# EAGLE design fpc_cable_all (EAGLE 9.6.2)
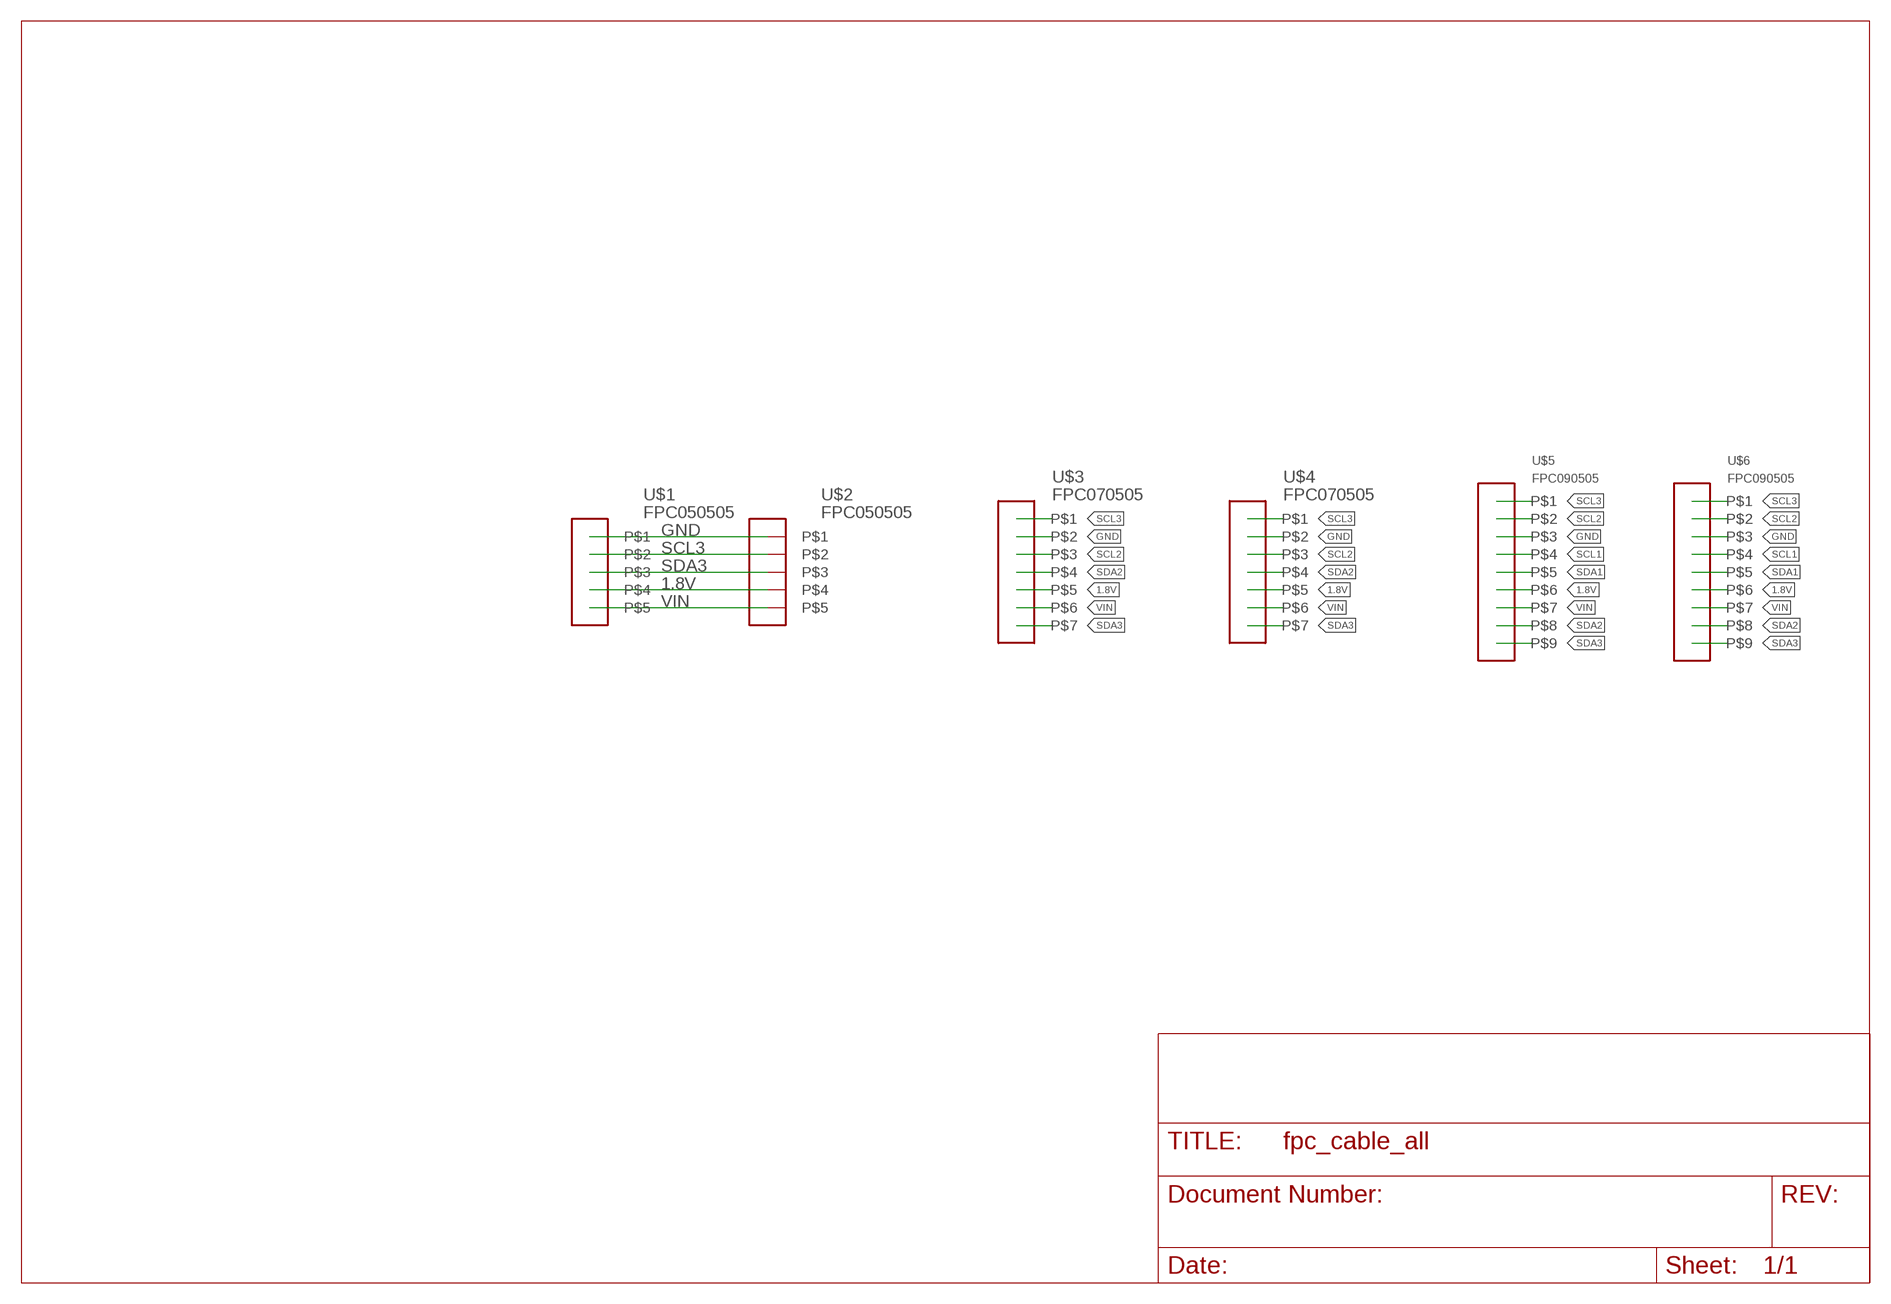
[diagram p0: schematic, sheet 1]

## Parts
U$1  FPC050505  [FPC0505]
U$2  FPC050505  [FPC0505]
U$3  FPC070505  [FPC0705]
U$4  FPC070505  [FPC0705]
U$5  FPC090505  [FPC0905]
U$6  FPC090505  [FPC0905]

## Nets
1.8V: U$1.P$4 U$2.P$4 U$3.P$5 U$4.P$5 U$5.P$6 U$6.P$6
GND: U$1.P$1 U$2.P$1 U$3.P$2 U$4.P$2 U$5.P$3 U$6.P$3
SCL1: U$5.P$4 U$6.P$4
SCL2: U$3.P$3 U$4.P$3 U$5.P$2 U$6.P$2
SCL3: U$1.P$2 U$2.P$2 U$3.P$1 U$4.P$1 U$5.P$1 U$6.P$1
SDA1: U$5.P$5 U$6.P$5
SDA2: U$3.P$4 U$4.P$4 U$5.P$8 U$6.P$8
SDA3: U$1.P$3 U$2.P$3 U$3.P$7 U$4.P$7 U$5.P$9 U$6.P$9
VIN: U$1.P$5 U$2.P$5 U$3.P$6 U$4.P$6 U$5.P$7 U$6.P$7

## Library data of the parts
U$1 U$2 = my_library:FPC0505
U$3 U$4 = my_library:FPC0705
U$5 U$6 = my_library:FPC0905

## Board
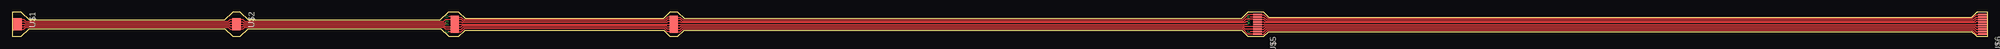
[diagram p1: board, top side]
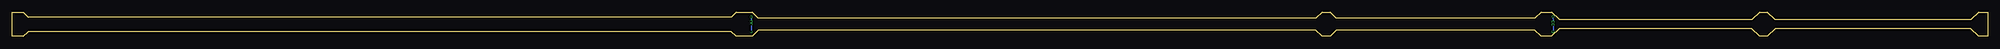
[diagram p2: board, bottom side, seen from below]

Size 406.1 x 5 mm. Coordinates in mm from the lower left corner, seen from the top.
Outline: 0,0 1.9,0 3.5,1.6 43.7,1.6 45.3,0 46.9,0 48.5,1.6 88.1,1.6 89.7,0 91.8,0 93.1,1.3 133.9,1.3 135.2,0 136.8,0 138.1,1.3 252.7,1.3 254,0 257.3,0 258.3,1 402.8,1 403.8,0 406.1,0 406.1,5 403.8,5 402.8,4 258.3,4 257.3,5 254,5 252.7,3.7 138.1,3.7 136.8,5 135.2,5 133.9,3.7 93.1,3.7 91.8,5 89.6,5 88,3.4 48.5,3.4 46.9,5 45.3,5 43.7,3.4 3.5,3.4 1.9,5 0,5 0,0
Copper layers (1*16): Top 0.035mm / dielectric 1.6mm / Bottom 0.035mm
Design rules "jlcpcb-2layers *": minimum track width 5mil, minimum drill 0.3mm, track to track 5mil, track to pad 5mil, pad to pad 5mil, via to via 5mil, smd to smd 5mil, copper to edge 0.2mm, drill to drill 6mil, minimum pad ring 10mil, minimum via ring 3mil, stop-mask expansion 4mil, vias tented up to drill 12mil, thermal gap 10mil

### Footprints (pad centres in the part's own frame; a part is rotated, then mirrored left to right if it is on the bottom)
FPC0505 = smd 0.3 x 1.7: P$1 -1,0.1; P$2 -0.5,0.1; P$3 0,0.1; P$4 0.5,0.1; P$5 1,0.1
FPC0705 = smd 0.3 x 1.7: P$1 -1.5,0; P$2 -1,0; P$3 -0.5,0; P$4 0,0; P$5 0.5,0; P$6 1,0; P$7 1.5,0
FPC0905 = smd 0.3 x 1.7: P$1 -2,0; P$2 -1.5,0; P$3 -1,0; P$4 -0.5,0; P$5 0,0; P$6 0.5,0; P$7 1,0; P$8 1.5,0; P$9 2,0

### Placement (x,y rotation side)
U$1  1,2.5 270 top
U$2  46,2.5 270 top
U$3  136,2.5 270 top
U$4  91,2.5 270 top
U$5  256,2.5 270 top
U$6  405,2.5 270 top

### Tracks (layer width: path | path; a pad name or v marks a point on that pad's centre or on a via)
1.8V
  Top 0.127: U$1.P$4 2.5,2 2.7,2.2 44.6,2.2 44.8,2 U$2.P$4 47.4,2 47.6,2.2 88.79,2.2 89.01,1.98 91,1.98 U$4.P$5 92.3,2 92.5,2.2 134.5,2.2 134.7,2 U$3.P$5 137.3,2 137.5,2.2 253.2,2.2 253.4,2 U$5.P$6 257.3,2 257.5,2.2 403.5,2.2 403.7,2 U$6.P$6
GND
  Top 0.127: U$1.P$1 2.4,3.5 2.8,3.1 44.4,3.1 44.8,3.5 U$2.P$1 47.4,3.5 47.8,3.1 88.7,3.1 89.1,3.5 U$4.P$2 92.3,3.5 92.7,3.1 134.3,3.1 134.7,3.5 U$3.P$2 137.3,3.5 137.7,3.1 253.2,3.1 253.6,3.5 U$5.P$3 257.3,3.5 257.7,3.1 403.3,3.1 403.7,3.5 U$6.P$3
SCL1
  Top 0.127: U$5.P$4 257.3,3 257.5,2.8 403.5,2.8 403.7,3 U$6.P$4
SCL2  (via drill 0.3)
  Top 0.127: U$4.P$3 92.3,3 92.5,2.8 134.5,2.8 134.7,3 U$3.P$3 137.3,3 137.5,2.8 253.31,2.8 253.59,3.08 v254.2,3.08 | v254.2,4 U$5.P$2 257.3,4 257.9,3.4 403.1,3.4 403.7,4 U$6.P$2
  Bottom 0.127: v254.2,4 v254.2,3.08
SCL3  (via drill 0.3)
  Top 0.127: 90.92,3.92 U$4.P$1 | U$4.P$1 92.3,4 92.9,3.4 134.1,3.4 134.7,4 U$3.P$1 137.3,4 137.9,3.4 252.9,3.4 254,4.5 U$5.P$1 257.3,4.5 258.1,3.7 402.9,3.7 403.7,4.5 U$6.P$1 | U$1.P$2 2.5,3 2.7,2.8 44.6,2.8 44.8,3 U$2.P$2 47.4,3 47.6,2.8 89.19,2.8 v89.38,3 | U$4.P$1 90.9,4.1 v89.4,4.1
  Bottom 0.127: v89.4,4.1 | v89.4,4.1 v89.38,3
SDA1
  Top 0.127: U$5.P$5 U$6.P$5
SDA2  (via drill 0.3)
  Top 0.127: 255.92,1.08 U$5.P$8 | v254.2,2.5 U$3.P$4 U$4.P$4 | U$5.P$8 v254.2,1 | U$5.P$8 257.3,1 257.9,1.6 403.1,1.6 403.7,1 U$6.P$8
  Bottom 0.127: v254.2,2.5 v254.2,1
SDA3  (via drill 0.3)
  Top 0.127: v89.4,1 U$4.P$7 92.3,1 92.9,1.6 134.1,1.6 134.7,1 U$3.P$7 137.3,1 137.9,1.6 252.9,1.6 254,0.5 U$5.P$9 257.3,0.5 258.1,1.3 402.9,1.3 403.7,0.5 U$6.P$9 | v89.38,2.4 89.27,2.5 U$2.P$3 U$1.P$3
  Bottom 0.127: v89.4,1 89.38,1.02 v89.38,2.4
VIN
  Top 0.127: U$1.P$5 2.4,1.5 2.8,1.9 44.4,1.9 44.8,1.5 U$2.P$5 47.4,1.5 47.8,1.9 88.7,1.9 89.1,1.5 U$4.P$6 92.3,1.5 92.7,1.9 134.3,1.9 134.7,1.5 U$3.P$6 137.3,1.5 137.7,1.9 253.1,1.9 253.5,1.5 U$5.P$7 257.3,1.5 257.7,1.9 403.3,1.9 403.7,1.5 U$6.P$7